# Altium schematic sheet PiZero2W_Hat.SchDoc
size A4; SheetNumber: 1; SheetTotal: 1
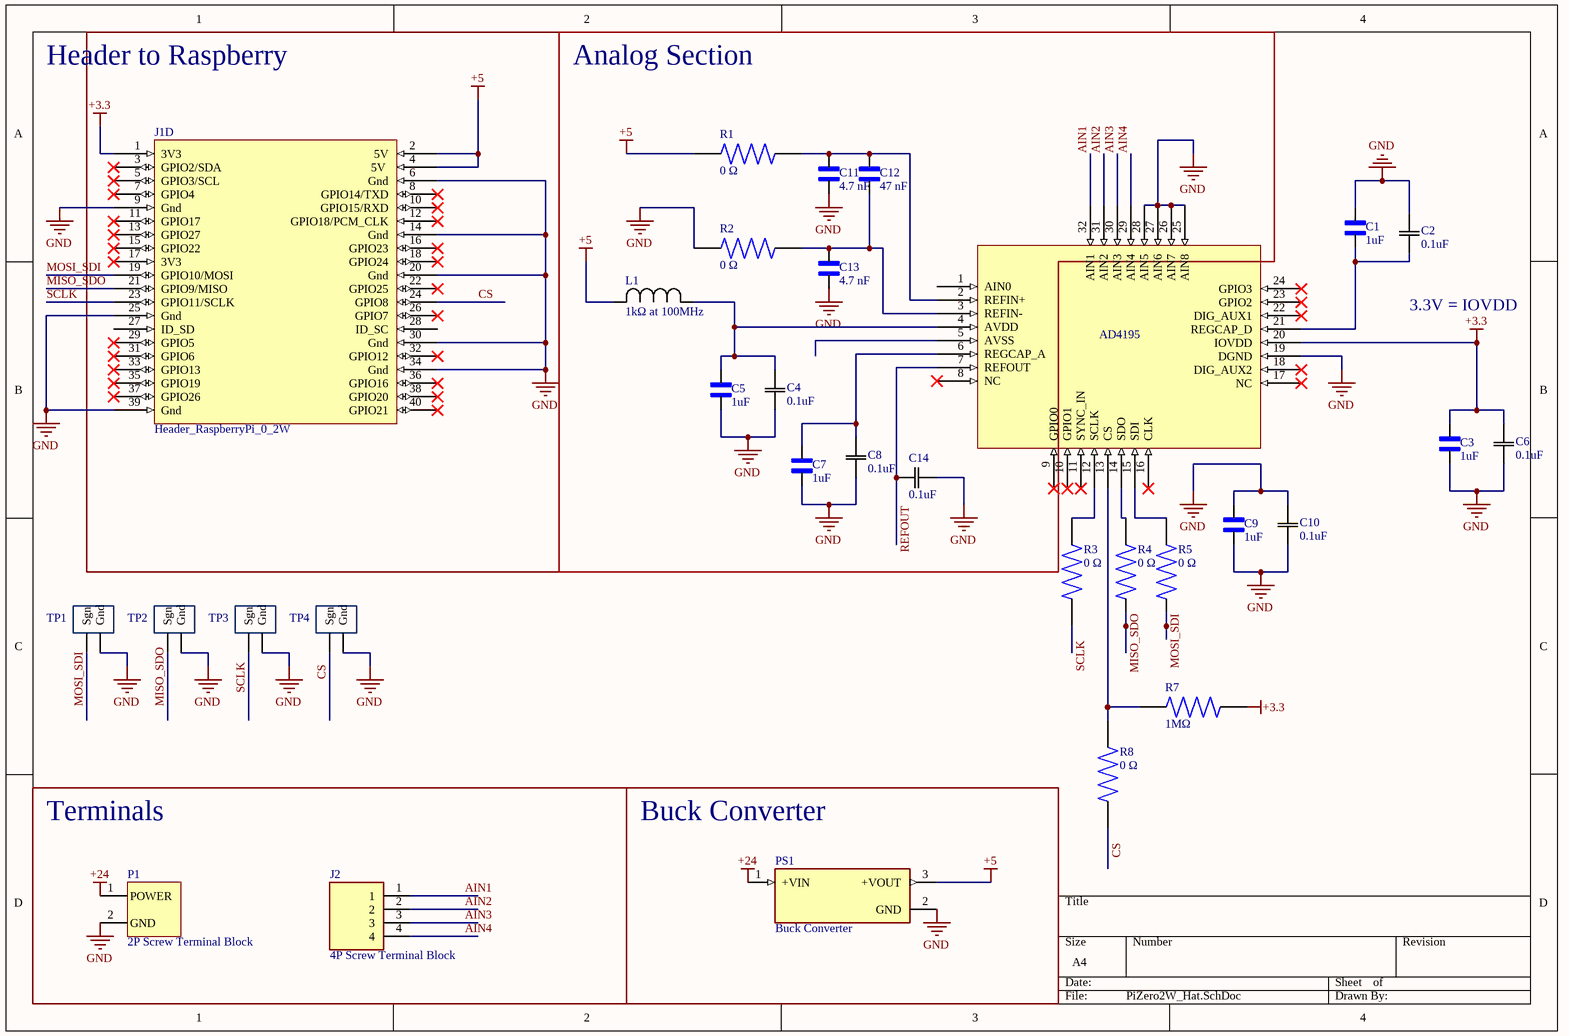
[diagram p0: PiZero2W_Hat.SchDoc]

## Parts
AD4195  omponent_1  [QFN50P400X600X80_HS-33N]  (value not drawn)
C1  1uF  [CAPC1608X90N]
C2  0.1uF  [0402_AVX]
C3  1uF  [CAPC1608X90N]
C4  0.1uF  [0402_AVX]
C5  1uF  [CAPC1608X90N]
C6  0.1uF  [0402_AVX]
C7  1uF  [CAPC1608X90N]
C8  0.1uF  [0402_AVX]
C9  1uF  [CAPC1608X90N]
C10  0.1uF  [0402_AVX]
C11  4.7 nF  [CAPC1608X90N]
C12  47 nF  [CAPC1005X55N]
C13  4.7 nF  [CAPC1608X90N]
C14  0.1uF  [0402_AVX]
J1  Header_RaspberryPi_0_2W  [Edge Connector]  (part D of 4)
J2  4P Screw Terminal Block  [TE_282834-4]
L1  1kΩ at 100MHz  [IND_1608_TDK]
P1  2P Screw Terminal Block  [P_Terminal block 3.5mm-pitch]
PS1  Buck Converter  [CONV_TSR_2-2450N]
R1  0 Ω  [RES_ERJ-2GE0R00X]
R2  0 Ω  [RES_ERJ-2GE0R00X]
R3  0 Ω  [RES_ERJ-2GE0R00X]
R4  0 Ω  [RES_ERJ-2GE0R00X]
R5  0 Ω  [RES_ERJ-2GE0R00X]
R7  1MΩ  [RES_ERJ2RKF1004X]
R8  0 Ω  [RES_ERJ-2GE0R00X]
TP1  10x Probe TP  [TP10x_Probe]  (value not drawn)
TP2  10x Probe TP  [TP10x_Probe]  (value not drawn)
TP3  10x Probe TP  [TP10x_Probe]  (value not drawn)
TP4  10x Probe TP  [TP10x_Probe]  (value not drawn)

## Blocks framed on the sheet
Analog Section: C4 C5 C7 C8 C11-C14 L1 R1 R2
Terminals: J2 P1
Buck Converter: PS1

## Nets
+3.3: AD4195.20(IOVDD) C3.2 C6.2 J1.1(3V3) R7.2
+5: J1.2(5V) J1.4(5V) L1.2 PS1.3(+VOUT) R1.2
+24: P1.1(POWER) PS1.1(+VIN)
GND: AD4195.19(DGND) AD4195.25(AIN8) AD4195.26(AIN7) AD4195.27(AIN6) AD4195.28(AIN5) C1.2 C2.2 C3.1 C4.1 C5.1 C6.1 C7.1 C8.1 C9.1 C9.2 C10.1 C10.2 C11.1 C13.1 C14.1 J1.6(Gnd) J1.9(Gnd) J1.14(Gnd) J1.20(Gnd) J1.25(Gnd) J1.30(Gnd) J1.34(Gnd) J1.39(Gnd) P1.2(GND) PS1.2(GND) R2.2 TP1.2(Gnd) TP2.2(Gnd) TP3.2(Gnd) TP4.2(Gnd)
AIN1: AD4195.32(AIN1) J2.1
AIN2: AD4195.31(AIN2) J2.2
AIN3: AD4195.30(AIN3) J2.3
AIN4: AD4195.29(AIN4) J2.4
CS: J1.24(GPIO8) R8.1 TP4.1(Sgn)
MISO_SDO: J1.21(GPIO9/MISO) R4.1 TP2.1(Sgn)
MOSI_SDI: J1.19(GPIO10/MOSI) R5.1 TP1.1(Sgn)
REFOUT: AD4195.7(REFOUT) C14.2
SCLK: J1.23(GPIO11/SCLK) R3.1 TP3.1(Sgn)
NetAD4195_2: AD4195.2(REFIN+) C11.2 C12.2 R1.1
NetAD4195_3: AD4195.3(REFIN-) C12.1 C13.2 R2.1
NetAD4195_4: AD4195.4(AVDD) C4.2 C5.2 L1.1
NetAD4195_6: AD4195.6(REGCAP_A) C7.2 C8.2
NetAD4195_12: AD4195.12(SCLK) R3.2
NetAD4195_13: AD4195.13(CS) R7.1 R8.2
NetAD4195_14: AD4195.14(SDO) R4.2
NetAD4195_15: AD4195.15(SDI) R5.2
NetAD4195_21: AD4195.21(REGCAP_D) C1.1 C2.1

Not connected (* = marked no-connect by the designer): AD4195 1(AIN0) 5(AVSS) 8(NC)* 9(GPIO0)* 10(GPIO1)* 11(SYNC_IN)* 16(CLK)* 17(NC)* 18(DIG_AUX2)* 22(DIG_AUX1)* 23(GPIO2)* 24(GPIO3)*; J1 3(GPIO2/SDA)* 5(GPIO3/SCL)* 7(GPIO4)* 8(GPIO14/TXD)* 10(GPIO15/RXD)* 11(GPIO17)* 12(GPIO18/PCM_CLK)* 13(GPIO27)* 15(GPIO22)* 16(GPIO23)* 17(3V3)* 18(GPIO24)* 22(GPIO25)* 26(GPIO7)* 27(ID_SD) 28(ID_SC) 29(GPIO5)* 31(GPIO6)* 32(GPIO12)* 33(GPIO13)* 35(GPIO19)* 36(GPIO16)* 37(GPIO26)* 38(GPIO20)* 40(GPIO21)*

## Notes on the sheet
- Header to Raspberry
- 3.3V = IOVDD

## Library data of the parts
AD4195 = Component_1
C1 C3 C5 C7 C9 = C0603C105K4RACTU: Package: None; Price: None; Value: *; MP: C0603C105K4RACTU; Availability: Unavailable
C2 C4 C6 C8 C10 C14 = 04023C104KAT2A: Description; Manufacturer_Name: KYOCERA AVX; Copyright: Copyright (C) 2025 Ultra Librarian. All rights reserved.; Manufacturer_Part_Number: 04023C104KAT2A
C11 C13 = GRM1885C1H472JA01D: 0603 4.7 nF 50 V Â±5% Tolerance C0G SMT Multilayer Ceramic Capacitor; MF: Murata; SnapEDA_Link: https://www.snapeda.com/parts/GRM1885C1H472JA01D/Murata/view-part/?ref=snap; Package: 1608 Murata; Value: *; MP: GRM1885C1H472JA01D; Check_prices: https://www.snapeda.com/parts/GRM1885C1H472JA01D/Murata/view-part/?ref=eda
C12 = GRM155R71E473KA88D: SMD capacitor X7R(EIA) with capacitance 47000pF Tol.10%. Rated voltage 25Vdc 125C; MF: Murata; SnapEDA_Link: https://www.snapeda.com/parts/GRM155R71E473KA88D/Murata/view-part/?ref=snap; Package: 1005-2 Murata; Value: *; MP: GRM155R71E473KA88D; Check_prices: https://www.snapeda.com/parts/GRM155R71E473KA88D/Murata/view-part/?ref=eda
J2 = 282834-4: Conn; Term Blk; PCB; Wire Receptacle; 4; 2.54mm; 30-16AWG; Green; 10A;150V; M1.6 | TE Connectivity 282834-4; Number_of_Positions: 4; Centerline_Pitch: 2.54 mm[.1 in]; SnapEDA_Link: https://www.snapeda.com/parts/282834-4/TE+Connectivity+AMP+Connectors/view-part/?ref=snap; Package: None; Value: *; MF: TE Connectivity; MP: 282834-4; EU_RoHS_Compliance: Compliant with Exemptions; Check_prices: https://www.snapeda.com/parts/282834-4/TE+Connectivity+AMP+Connectors/view-part/?ref=eda
L1 = MPZ1608S102ATA00: Description; Manufacturer_Name: TDK; Copyright: Copyright (C) 2025 Ultra Librarian. All rights reserved.; Manufacturer_Part_Number: MPZ1608S102ATA00
P1 = P_Terminal block: Green Straight pin 3.5mm  pitch; P=3.5mm  Screw terminal ROHS; MFR Part #: KF350-3.5-2P; Manufacturer: Cixi Kefa Elec; LCSC Part#: C474892; DataSheet: https://datasheet.lcsc.com/lcsc/2001160007_Cixi-Kefa-Elec-KF350-3-5-2P_C474892.pdf
PS1 = TSR_2-2450N: MF: {'manufacturer': u'Traco Power'}; Package: None; Price: None; Value: *; MP: TSR_2-2450N; Availability: Unavailable
R1-R5 R8 = ERJ-2GE0R00X: Series/Type: Thick Film Chip Resistors, Power Rating (W): -, Chip Size (LxW(EIA)) (mm): 1.0 x 0.5 (EIA:0402), Resistance Values (â„¦): 0, Resistance Tolerance (%): Not specified, T.C.R (Ã—10â»â¶/K): Not specified; MF: Panasonic; SnapEDA_Link: https://www.snapeda.com/parts/ERJ-2GE0R00X/Panasonic+Electronic+Components/view-part/?ref=snap; Package: 1020-2 Panasonic; Value: *; MP: ERJ-2GE0R00X; Check_prices: https://www.snapeda.com/parts/ERJ-2GE0R00X/Panasonic+Electronic+Components/view-part/?ref=eda
R7 = ERJ2RKF1004X: 1 MOhms 1% 0.1W, 1/10W Chip Resistor 0402 (1005 Metric) Automotive AEC-Q200 Thick Film; MF: Panasonic Electronic; MP: ERJ-2RKF1004X; SnapEDA_Link: https://www.snapeda.com/parts/ERJ-2RKF1004X/Panasonic+Electronic+Components/view-part/?ref=snap; Package: 1005-2 Panasonic; Value: *; Check_prices: https://www.snapeda.com/parts/ERJ-2RKF1004X/Panasonic+Electronic+Components/view-part/?ref=eda
TP1-TP4 = TP_10x_Probe: Test Point 300 mil centers